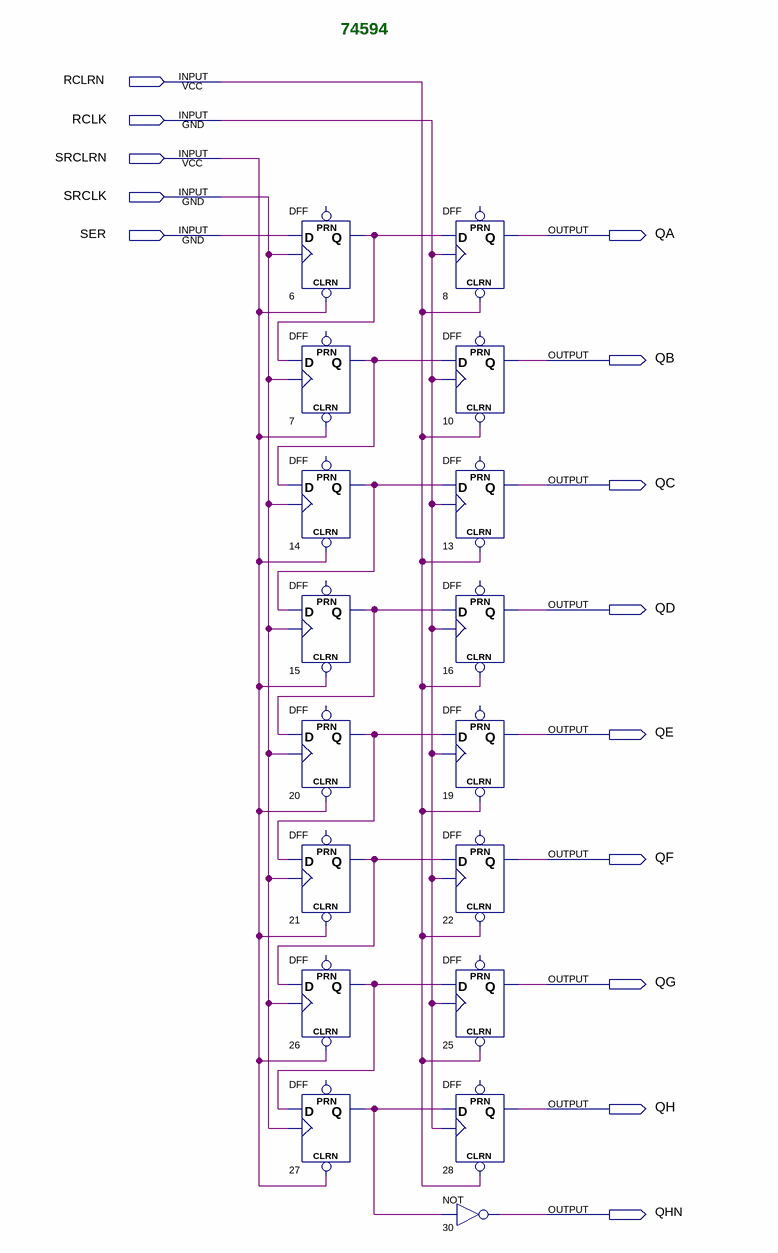
[diagram p0: schematic sheet]
// Quartus schematic 74594.bdf as structural Verilog: 17 symbols, 14 pins
module \74594  (
  input  RCLRN,
  input  RCLK,
  input  SRCLRN,
  input  SRCLK,
  input  SER,
  output QA,
  output QB,
  output QC,
  output QD,
  output QE,
  output QF,
  output QG,
  output QH,
  output QHN
);

  wire n6_q, n7_q, n14_q, n15_q, n20_q, n21_q, n26_q, n27_q;

  DFF u_6 (.CLRN(SRCLRN), .CLK(SRCLK), .D(SER), .Q(n6_q));  // open: PRN
  DFF u_7 (.CLRN(SRCLRN), .CLK(SRCLK), .D(n6_q), .Q(n7_q));  // open: PRN
  DFF u_14 (.CLRN(SRCLRN), .CLK(SRCLK), .D(n7_q), .Q(n14_q));  // open: PRN
  DFF u_15 (.CLRN(SRCLRN), .CLK(SRCLK), .D(n14_q), .Q(n15_q));  // open: PRN
  DFF u_20 (.CLRN(SRCLRN), .CLK(SRCLK), .D(n15_q), .Q(n20_q));  // open: PRN
  DFF u_21 (.CLRN(SRCLRN), .CLK(SRCLK), .D(n20_q), .Q(n21_q));  // open: PRN
  DFF u_26 (.CLRN(SRCLRN), .CLK(SRCLK), .D(n21_q), .Q(n26_q));  // open: PRN
  DFF u_27 (.CLRN(SRCLRN), .CLK(SRCLK), .D(n26_q), .Q(n27_q));  // open: PRN
  DFF u_8 (.CLRN(RCLRN), .CLK(RCLK), .D(n6_q), .Q(QA));  // open: PRN
  DFF u_10 (.CLRN(RCLRN), .CLK(RCLK), .D(n7_q), .Q(QB));  // open: PRN
  DFF u_13 (.CLRN(RCLRN), .CLK(RCLK), .D(n14_q), .Q(QC));  // open: PRN
  DFF u_16 (.CLRN(RCLRN), .CLK(RCLK), .D(n15_q), .Q(QD));  // open: PRN
  DFF u_19 (.CLRN(RCLRN), .CLK(RCLK), .D(n20_q), .Q(QE));  // open: PRN
  DFF u_22 (.CLRN(RCLRN), .CLK(RCLK), .D(n21_q), .Q(QF));  // open: PRN
  DFF u_25 (.CLRN(RCLRN), .CLK(RCLK), .D(n26_q), .Q(QG));  // open: PRN
  DFF u_28 (.CLRN(RCLRN), .CLK(RCLK), .D(n27_q), .Q(QH));  // open: PRN
  not u_30 (QHN, n27_q);

  // Notes on the sheet:
  //   74594
endmodule
